# EAGLE design project (EAGLE 9.5.0)
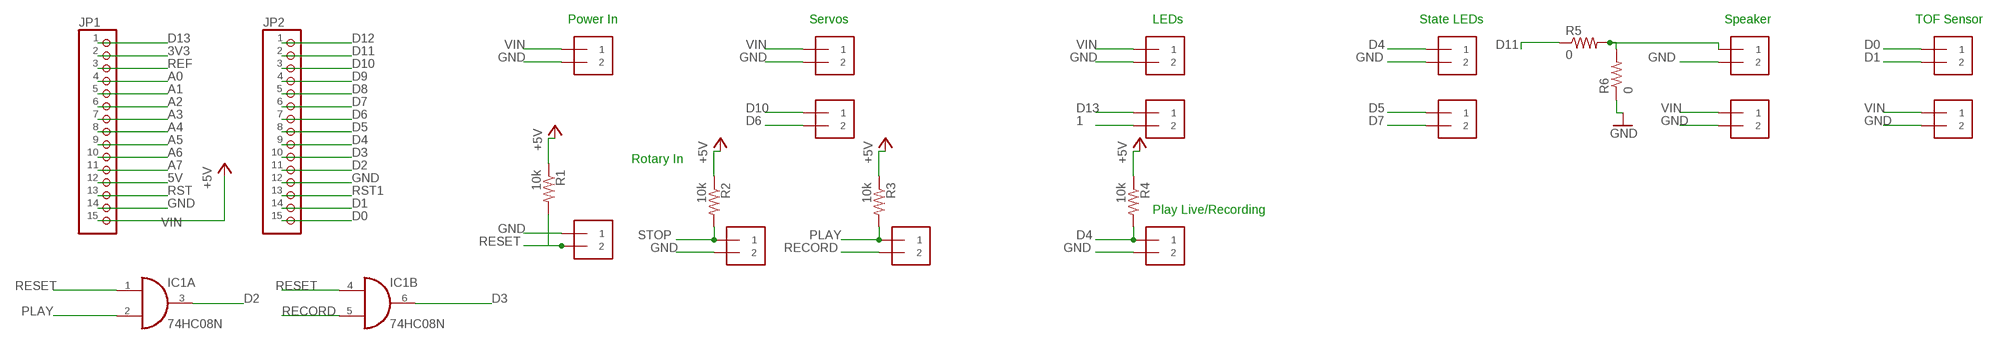
[diagram p0: schematic, sheet 1]

## Parts
IC1  74HC08N  [DIL14]
J1  1X2-3.5MM  [1X2-3.5MM]
J2  1X2-3.5MM  [1X2-3.5MM]
J3  1X2-3.5MM  [1X2-3.5MM]
J4  1X2-3.5MM  [1X2-3.5MM]
JP1  PINHD-1X15  [1X15]
JP2  PINHD-1X15  [1X15]
LED1  1X2-3.5MM  [1X2-3.5MM]
LED2_3  1X2-3.5MM  [1X2-3.5MM]
LED_PWR  1X2-3.5MM  [1X2-3.5MM]
LED_SIG  1X2-3.5MM  [1X2-3.5MM]
POWER  1X2-3.5MM  [1X2-3.5MM]
R1  10k  R-US_M0805  [M0805]
R2  10k  R-US_M0805  [M0805]
R3  10k  R-US_M0805  [M0805]
R4  10k  R-US_M0805  [M0805]
R5  0  R-US_M0805  [M0805]
R6  0  R-US_M0805  [M0805]
SERVO_PWR  1X2-3.5MM  [1X2-3.5MM]
SERVO_SIG  1X2-3.5MM  [1X2-3.5MM]
SPK_PWR  1X2-3.5MM  [1X2-3.5MM]
SPK_SIG  1X2-3.5MM  [1X2-3.5MM]
TOF_PWR  1X2-3.5MM  [1X2-3.5MM]
TOF_SIG  1X2-3.5MM  [1X2-3.5MM]

## Nets
1: LED_SIG.2
3V3: JP1.2
5V: JP1.12
A0: JP1.4
A1: JP1.5
A2: JP1.6
A3: JP1.7
A4: JP1.8
A5: JP1.9
A6: JP1.10
A7: JP1.11
D0: JP2.15 TOF_SIG.1
D1: JP2.14 TOF_SIG.2
D2: IC1.3(A:O) JP2.11
D3: IC1.6(B:O) JP2.10
D4: J1.1 JP2.9 LED1.1 R4.2
D5: JP2.8 LED2_3.1
D6: JP2.7 SERVO_SIG.2
D7: JP2.6 LED2_3.2
D8: JP2.5
D9: JP2.4
D10: JP2.3 SERVO_SIG.1
D11: JP2.2 R5.1
D12: JP2.1
D13: JP1.1 LED_SIG.1
GND: J1.2 J3.2 J4.1 JP1.14 JP2.12 LED1.2 LED_PWR.2 POWER.2 R6.1 SERVO_PWR.2 SPK_PWR.2 SPK_SIG.2 TOF_PWR.2
N$1: R5.2 R6.2 SPK_SIG.1
PLAY: IC1.2(A:I1) J2.1 R3.2
RECORD: IC1.5(B:I1) J2.2
REF: JP1.3
RESET: IC1.1(A:I0) IC1.4(B:I0) J4.2 R1.2
RST: JP1.13
RST1: JP2.13
STOP: J3.1 R2.2
VIN: JP1.15 LED_PWR.1 POWER.1 R1.1 R2.1 R3.1 R4.1 SERVO_PWR.1 SPK_PWR.1 TOF_PWR.1 ; supply symbol labelled +5V
Unconnected: IC1.8(C:O) IC1.9(C:I0) IC1.10(C:I1) IC1.11(D:O) IC1.12(D:I0) IC1.13(D:I1)

## Notes on the sheet
- Power In | Servos | LEDs | State LEDs | Speaker | TOF Sensor
- Rotary In
- Play Live/Recording

## Power pins joined to a net without a drawn wire
GND: IC1.7(P:GND)
VCC: IC1.14(P:VCC)

## Library data of the parts
IC1 = 74xx-eu:74*08: Quad 2-input AND gate
J1-J4 LED1 LED2_3 LED_PWR LED_SIG POWER SERVO_PWR SERVO_SIG SPK_PWR SPK_SIG TOF_PWR TOF_SIG = adafruit:1X2: 3.5mm Terminal block http://www.ladyada.net/library/pcb/eaglelibrary.html
JP1 JP2 = adafruit:PINHD-1X15: PIN HEADER
R1-R6 = adafruit:R-US_: RESISTOR, American symbol

## Net classes
0 default: width 0.305 mm, drill 0.508 mm, clearance 0.254 mm

## Board
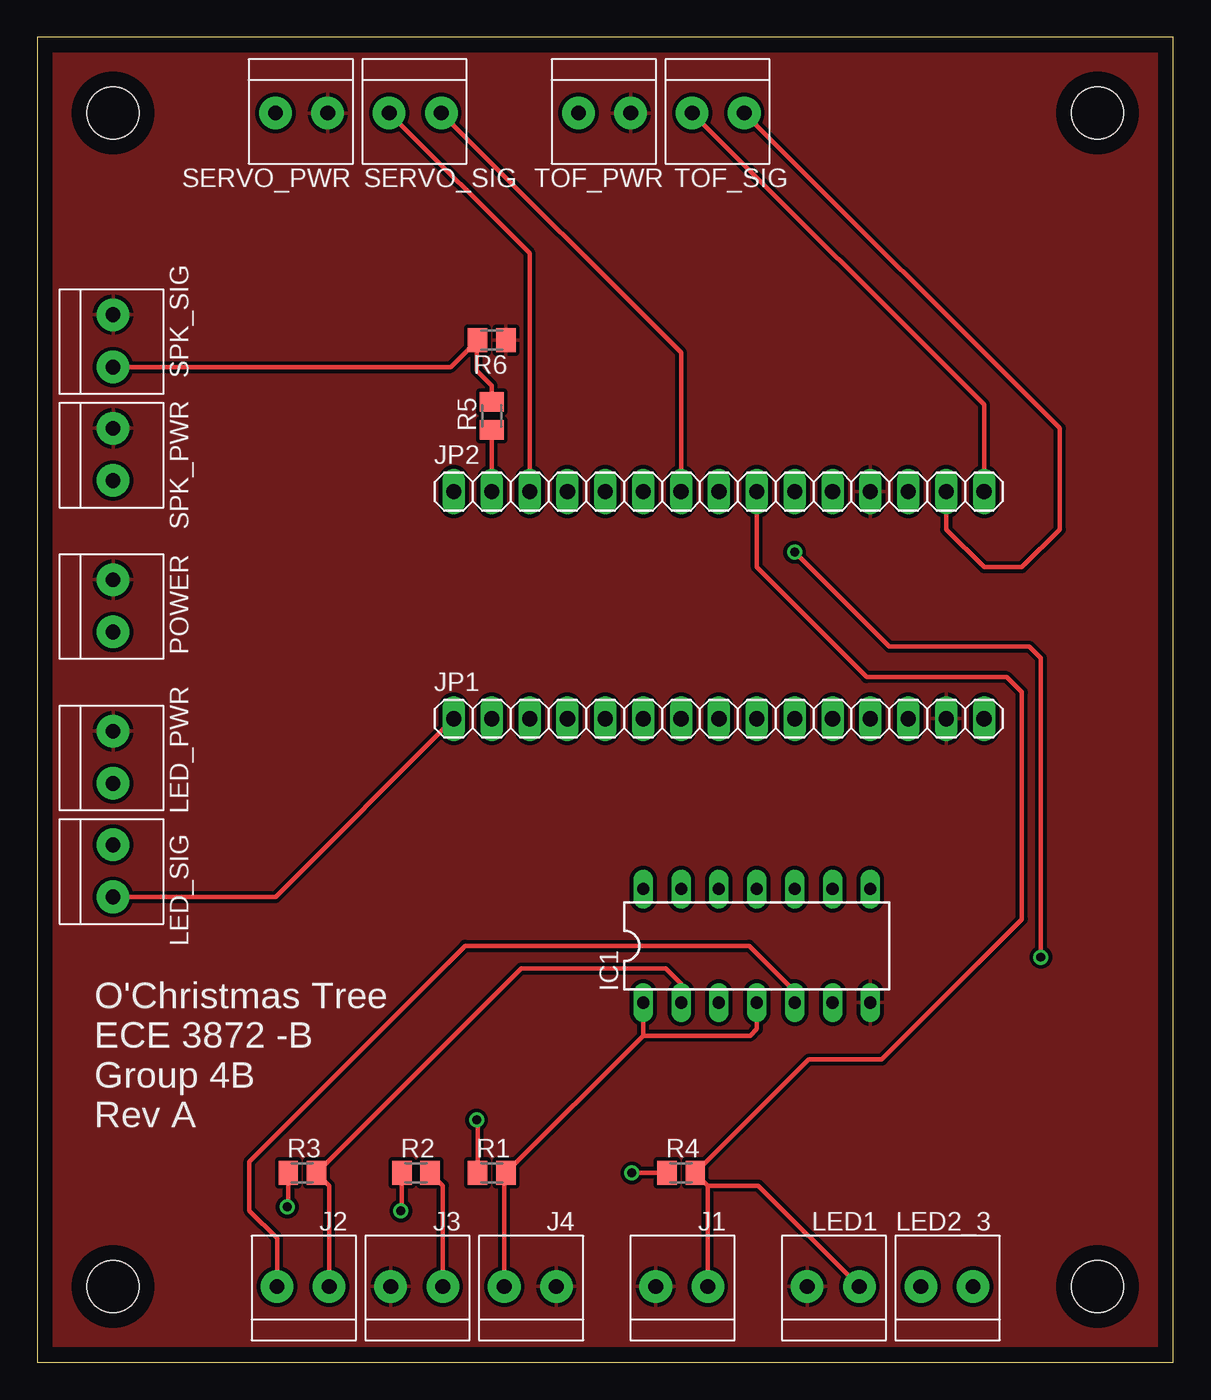
[diagram p1: board, top side]
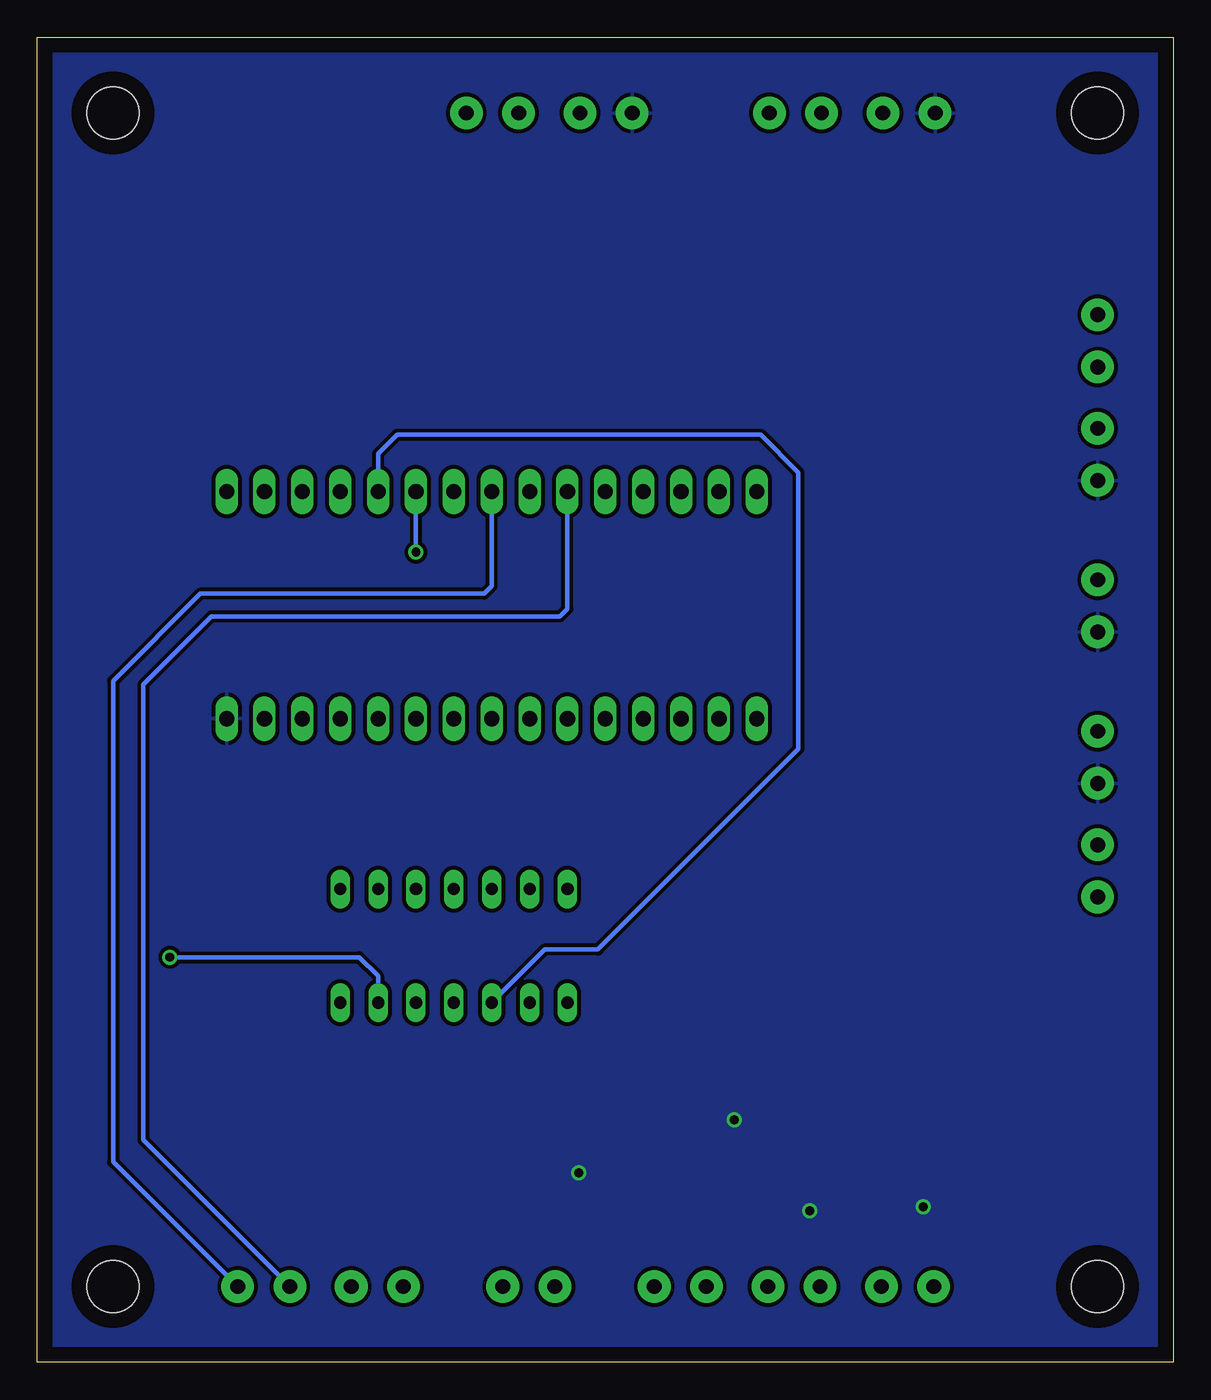
[diagram p2: board, bottom side, seen from below]

Size 76.2 x 88.9 mm. Coordinates in mm from the lower left corner, seen from the top.
Outline: 0,0 76.2,0 76.2,88.9 0,88.9 0,0
Copper layers (1*16): Top 0.035mm / dielectric 1.5mm / Bottom 0.035mm
Design rules "default": minimum track width 6mil, minimum drill 0.35mm, track to track 6mil, track to pad 6mil, pad to pad 6mil, via to via 6mil, smd to smd 6mil, copper to edge 40mil, drill to drill 6mil, minimum pad ring 10mil, minimum via ring 8mil, stop-mask expansion 4mil, vias tented up to drill 0mil, thermal gap 10mil
Holes 3.5 mm at 5.08,5.08 71.12,5.08 71.12,83.82 5.08,83.82

### Footprints (pad centres in the part's own frame; a part is rotated, then mirrored left to right if it is on the bottom)
DIL14 = drill 0.813 long: 1 -7.62,-3.81; 2 -5.08,-3.81; 3 -2.54,-3.81; 4 0,-3.81; 5 2.54,-3.81; 6 5.08,-3.81; 7 7.62,-3.81; 8 7.62,3.81; 9 5.08,3.81; 10 2.54,3.81; 11 0,3.81; 12 -2.54,3.81; 13 -5.08,3.81; 14 -7.62,3.81
1X2-3.5MM = drill 1 pad 2.184: 1 1.8,0; 2 -1.7,0
1X15 = drill 1.016 long: 1 -17.78,0; 2 -15.24,0; 3 -12.7,0; 4 -10.16,0; 5 -7.62,0; 6 -5.08,0; 7 -2.54,0; 8 0,0; 9 2.54,0; 10 5.08,0; 11 7.62,0; 12 10.16,0; 13 12.7,0; 14 15.24,0; 15 17.78,0
M0805 = smd 1.3 x 1.6: 1 -0.95,0; 2 0.95,0

### Placement (x,y rotation side)
IC1  48.26,27.94 0 top
J1  43.18,5.08 0 top
J2  17.78,5.08 0 top
J3  25.4,5.08 0 top
J4  33.02,5.08 0 top
JP1  45.72,43.18 0 top
JP2  45.72,58.42 0 top
LED1  53.34,5.08 0 top
LED2_3  60.96,5.08 0 top
LED_PWR  5.08,40.64 270 top
LED_SIG  5.08,33.02 270 top
POWER  5.08,50.8 270 top
R1  30.48,12.7 0 top
R2  25.4,12.7 0 top
R3  17.78,12.7 0 top
R4  43.18,12.7 0 top
R5  30.48,63.5 90 top
R6  30.48,68.58 180 top
SERVO_PWR  17.78,83.82 180 top
SERVO_SIG  25.4,83.82 180 top
SPK_PWR  5.08,60.96 270 top
SPK_SIG  5.08,68.58 270 top
TOF_PWR  38.1,83.82 180 top
TOF_SIG  45.72,83.82 180 top

### Tracks (layer width: path | path; a pad name or v marks a point on that pad's centre or on a via)
D0
  Top 0.305: JP2.15 63.5,64.24 TOF_SIG.1
D1
  Top 0.305: JP2.14 60.96,55.88 63.5,53.34 66.04,53.34 68.58,55.88 68.58,62.66 TOF_SIG.2
D2
  Bottom 0.305: JP2.11 53.34,60.96 52.07,62.23 27.69,62.23 25.15,59.69 25.15,41.15 38.61,27.69 42.16,27.69 IC1.3
D3  (via drill 0.6)
  Top 0.305: v50.8,54.36 57.15,48.01 66.55,48.01 67.31,47.24 v67.31,27.18
  Bottom 0.305: JP2.10 v50.8,54.36 | v67.31,27.18 54.61,27.18 53.34,25.91 IC1.6
D4
  Top 0.305: J1.1 44.98,11.85 | 44.98,11.85 R4.2 51.75,20.32 56.64,20.32 66.04,29.72 66.04,44.96 65.02,45.97 55.63,45.97 48.26,53.34 JP2.9 | LED1.1 48.37,11.85 44.98,11.85
D5
  Bottom 0.305: LED2_3.1 71.12,13.44 71.12,45.72 65.28,51.56 46.23,51.56 45.72,52.07 JP2.8
D6
  Top 0.305: JP2.7 43.18,67.74 SERVO_SIG.2
D7
  Bottom 0.305: LED2_3.2 69.09,14.91 69.09,45.47 64.52,50.04 41.15,50.04 40.64,50.55 JP2.6
D10
  Top 0.305: SERVO_SIG.1 33.02,74.4 JP2.3
D11
  Top 0.305: JP2.2 R5.1
D13
  Top 0.305: LED_SIG.1 15.98,31.22 JP1.1
GND
  pour Top: -2.54,91.44 -2.54,-2.54 78.74,-2.54 78.74,91.44
N$1
  Top 0.305: SPK_SIG.1 27.73,66.78 R6.2 29.46,68.51 29.46,66.55 30.48,65.53 R5.2
PLAY
  Top 0.305: J2.1 19.58,11.85 R3.2 32.45,26.42 42.16,26.42 43.18,25.4 IC1.2
RECORD
  Top 0.305: J2.2 16.08,8.3 14.22,10.16 14.22,13.46 28.7,27.94 47.75,27.94 50.8,24.89 IC1.5
RESET
  Top 0.305: J4.2 31.32,12.59 R1.2 40.64,21.91 | 40.64,21.91 IC1.1 | IC1.4 48.26,22.35 47.82,21.91 40.64,21.91
STOP
  Top 0.305: J3.1 27.2,11.85 R2.2
VIN  (via drill 0.6)
  Top 0.305: R3.1 16.83,10.48 v16.76,10.41 | R2.1 24.45,10.23 v24.38,10.16 | R1.1 29.53,16.19 v29.46,16.26 | R4.1 v39.88,12.7
  pour Bottom: -2.54,91.44 -2.54,-2.54 78.74,-2.54 78.74,91.44

### Text on the board
_tsilk: O'Christmas Tree / ECE 3872 -B / Group 4B / Rev A